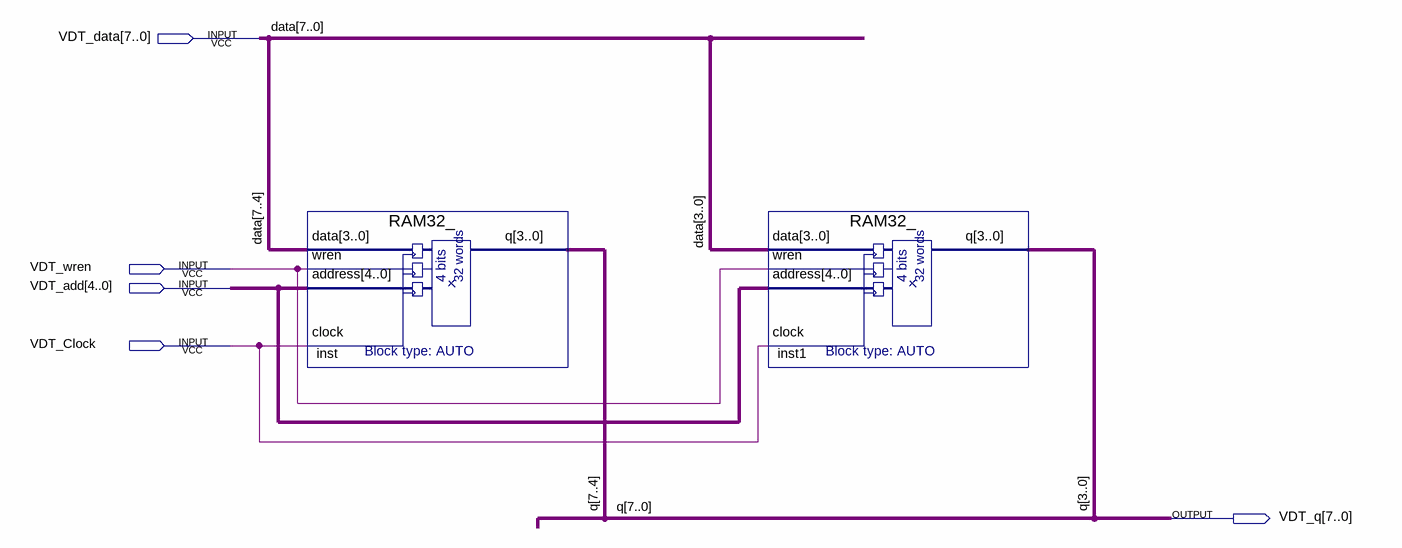
[diagram p0: schematic sheet]
// Quartus schematic assignment10.bdf as structural Verilog: 2 symbols, 5 pins
module assignment10 (
  input  [7:0] VDT_data,
  input  VDT_wren,
  input  [4:0] VDT_add,
  input  VDT_Clock,
  output [7:0] VDT_q
);

  RAM32_ inst (.data(VDT_data[7:4]), .wren(VDT_wren), .address(VDT_add), .clock(VDT_Clock), .q(VDT_q[7:4]));
  RAM32_ inst1 (.data(VDT_data[3:0]), .wren(VDT_wren), .address(VDT_add), .clock(VDT_Clock), .q(VDT_q[3:0]));

  // Other names for the same wires on the sheet: data[7:0] = VDT_data; q[7:0] = VDT_q
endmodule
